# Altium schematic sheet MB-09-Mot-Three_phase.SchDoc
size A4
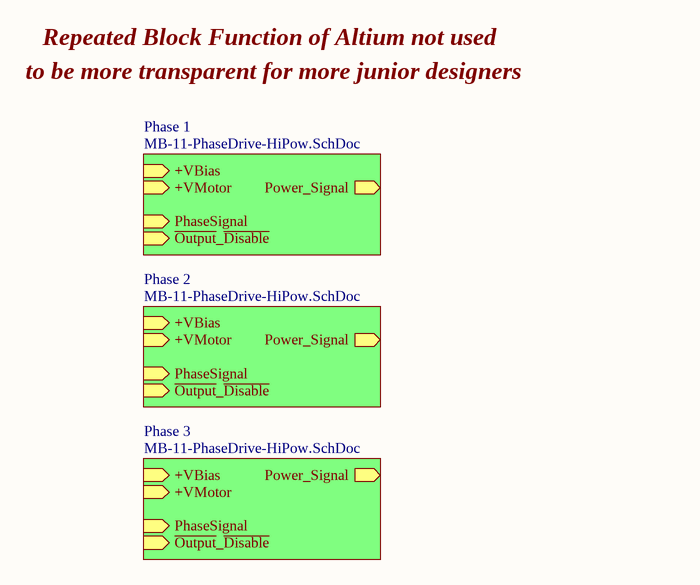
[diagram p0: MB-09-Mot-Three_phase.SchDoc]

## Sub-sheets
Phase 1 = MB-11-PhaseDrive-HiPow.SchDoc: +VMotor (in), +VBias (in), Power_Signal (out), ~{Output}_~{Disable} (in), PhaseSignal (in)
Phase 2 = MB-11-PhaseDrive-HiPow.SchDoc: +VMotor (in), +VBias (in), Power_Signal (out), ~{Output}_~{Disable} (in), PhaseSignal (in)
Phase 3 = MB-11-PhaseDrive-HiPow.SchDoc: +VMotor (in), +VBias (in), Power_Signal (out), ~{Output}_~{Disable} (in), PhaseSignal (in)

## Notes on the sheet
- to be more transparent for more junior designers
- Repeated Block Function of Altium not used